# EAGLE schematic swift-nav (EAGLE 6.1)

## Sheet 1 of 2
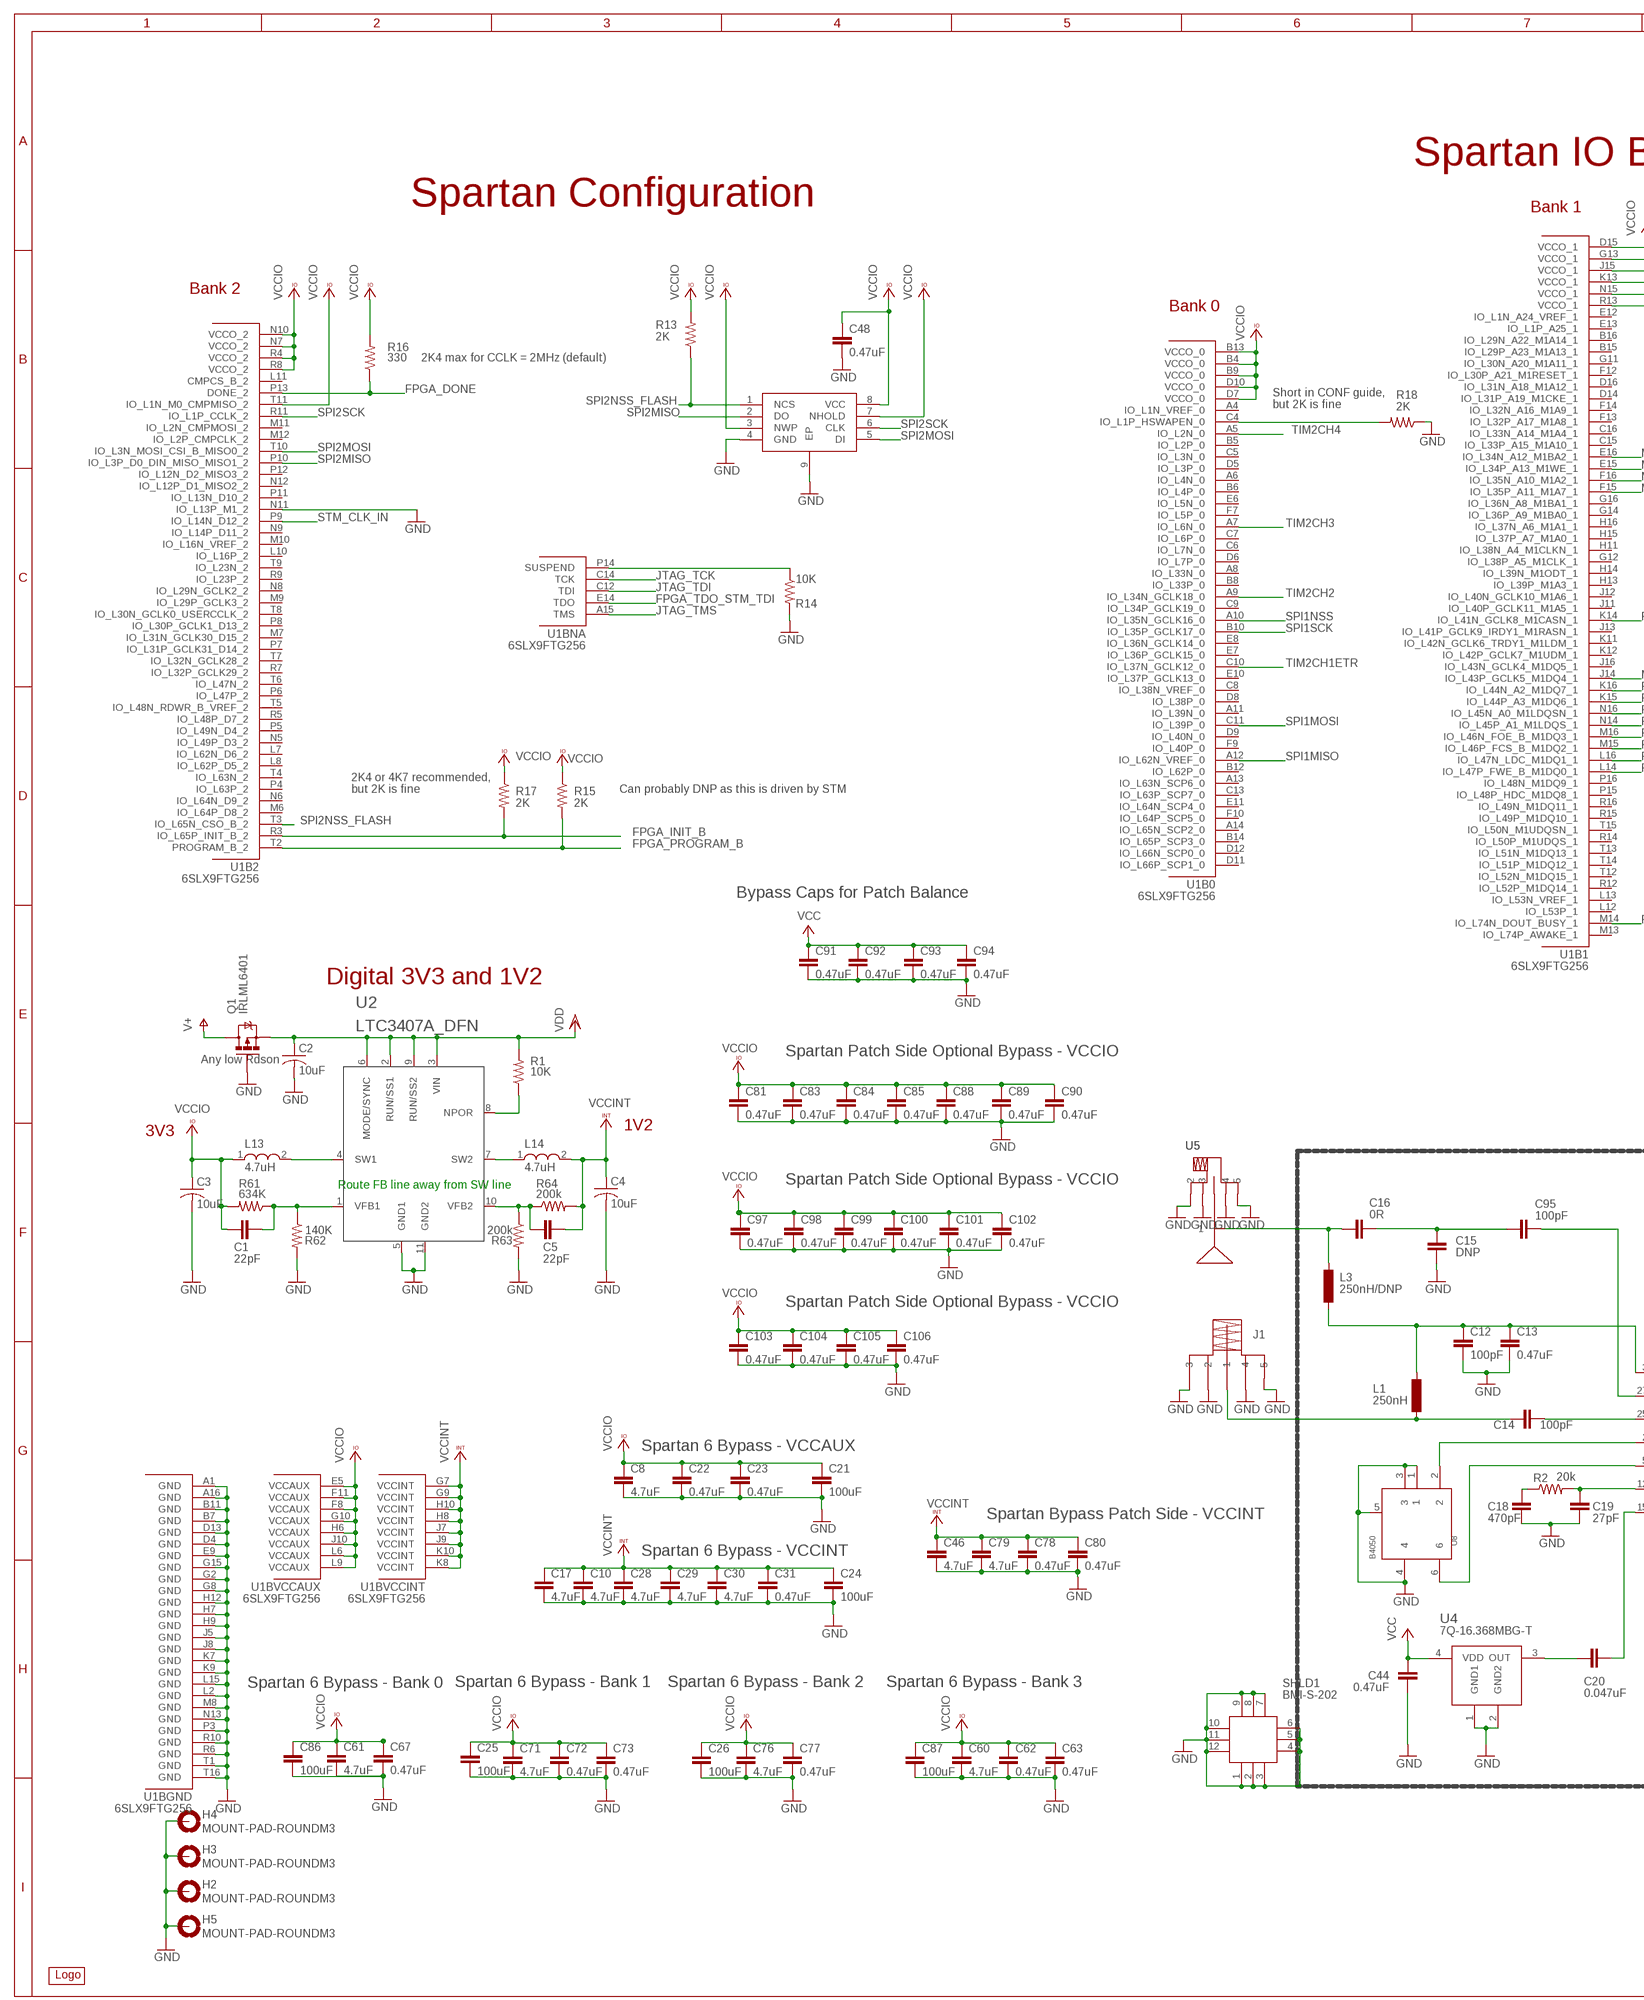
[diagram p0: schematic, sheet 1, part 1 of 2]
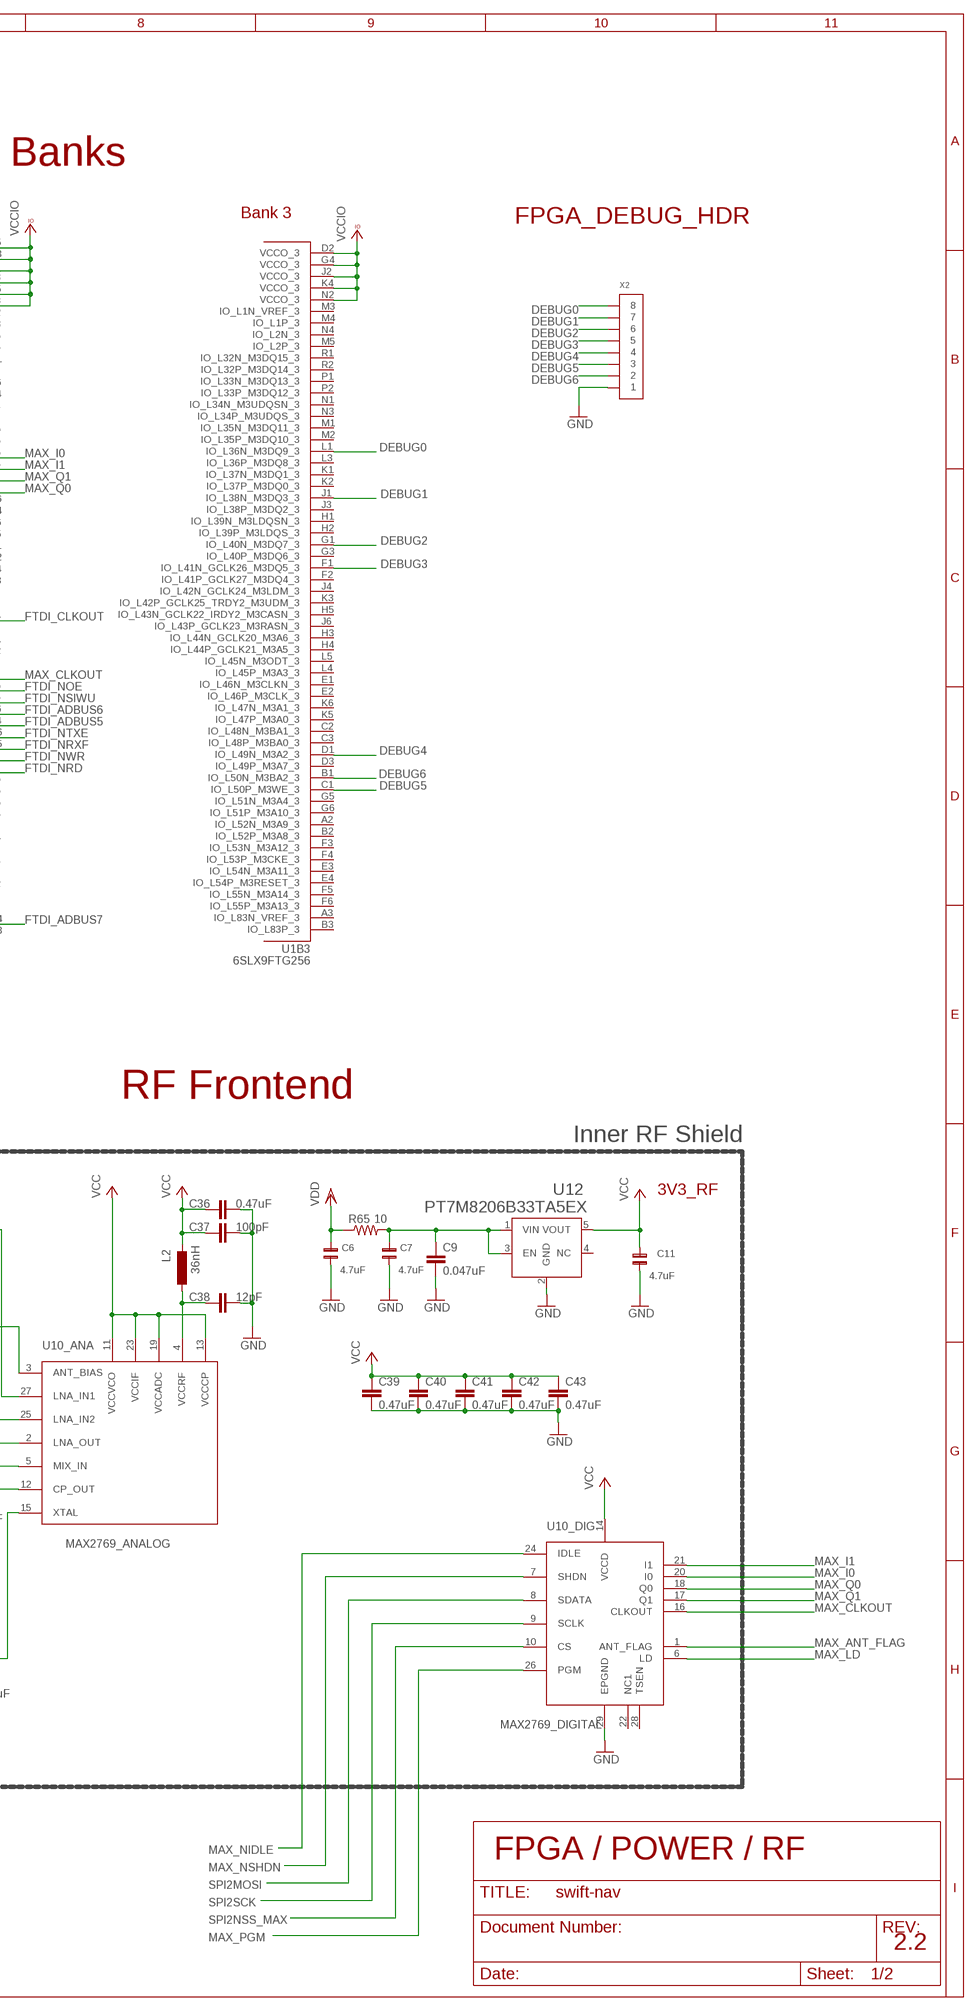
[diagram p1: schematic, sheet 1, part 2 of 2]

### Parts
C1  22pF  C-EUC0402  [C0402]
C2  10uF  C-USC1206  [C1206]
C3  10uF  C-USC1206  [C1206]
C4  10uF  C-USC1206  [C1206]
C5  22pF  C-EUC0402  [C0402]
C6  4.7uF  C0603  [0603]
C7  4.7uF  C0603  [0603]
C8  4.7uF  C-EUC0603K  [C0603K]
C9  0.047uF  C-EUC0402  [C0402]
C10  4.7uF  C-EUC0603K  [C0603K]
C11  4.7uF  C0603  [0603]
C12  100pF  C-EUC0402  [C0402]
C13  0.47uF  C-EUC0402  [C0402]
C14  100pF  C-EUC0402  [C0402]
C15  DNP  C-EUC0402  [C0402]
C16  0R  C-EUC0402  [C0402]
C17  4.7uF  C-EUC0603K  [C0603K]
C18  470pF  C-EUC0402  [C0402]
C19  27pF  C-EUC0402  [C0402]
C20  0.047uF  C-EUC0402  [C0402]
C21  100uF  C-EUC1210K  [C1210K]
C22  0.47uF  C-EUC0402  [C0402]
C23  0.47uF  C-EUC0402  [C0402]
C24  100uF  C-EUC1210K  [C1210K]
C25  100uF  C-EUC1210K  [C1210K]
C26  100uF  C-EUC1210K  [C1210K]
C28  4.7uF  C-EUC0603K  [C0603K]
C29  4.7uF  C-EUC0603K  [C0603K]
C30  4.7uF  C-EUC0603K  [C0603K]
C31  0.47uF  C-EUC0402  [C0402]
C36  0.47uF  C-EUC0402  [C0402]
C37  100pF  C-EUC0402  [C0402]
C38  12pF  C-EUC0402  [C0402]
C39  0.47uF  C-EUC0402  [C0402]
C40  0.47uF  C-EUC0402  [C0402]
C41  0.47uF  C-EUC0402  [C0402]
C42  0.47uF  C-EUC0402  [C0402]
C43  0.47uF  C-EUC0402  [C0402]
C44  0.47uF  C-EUC0402  [C0402]
C46  4.7uF  C-EUC0603K  [C0603K]
C48  0.47uF  C-EUC0402  [C0402]
C60  4.7uF  C-EUC0603K  [C0603K]
C61  4.7uF  C-EUC0603K  [C0603K]
C62  0.47uF  C-EUC0402  [C0402]
C63  0.47uF  C-EUC0402  [C0402]
C67  0.47uF  C-EUC0402  [C0402]
C71  4.7uF  C-EUC0603K  [C0603K]
C72  0.47uF  C-EUC0402  [C0402]
C73  0.47uF  C-EUC0402  [C0402]
C76  4.7uF  C-EUC0603K  [C0603K]
C77  0.47uF  C-EUC0402  [C0402]
C78  0.47uF  C-EUC0402  [C0402]
C79  4.7uF  C-EUC0603K  [C0603K]
C80  0.47uF  C-EUC0402  [C0402]
C81  0.47uF  C-EUC0402  [C0402]
C83  0.47uF  C-EUC0402  [C0402]
C84  0.47uF  C-EUC0402  [C0402]
C85  0.47uF  C-EUC0402  [C0402]
C86  100uF  C-EUC1210K  [C1210K]
C87  100uF  C-EUC1210K  [C1210K]
C88  0.47uF  C-EUC0402  [C0402]
C89  0.47uF  C-EUC0402  [C0402]
C90  0.47uF  C-EUC0402  [C0402]
C91  0.47uF  C-EUC0402  [C0402]
C92  0.47uF  C-EUC0402  [C0402]
C93  0.47uF  C-EUC0402  [C0402]
C94  0.47uF  C-EUC0402  [C0402]
C95  100pF  C-EUC0402  [C0402]
C97  0.47uF  C-EUC0402  [C0402]
C98  0.47uF  C-EUC0402  [C0402]
C99  0.47uF  C-EUC0402  [C0402]
C100  0.47uF  C-EUC0402  [C0402]
C101  0.47uF  C-EUC0402  [C0402]
C102  0.47uF  C-EUC0402  [C0402]
C103  0.47uF  C-EUC0402  [C0402]
C104  0.47uF  C-EUC0402  [C0402]
C105  0.47uF  C-EUC0402  [C0402]
C106  0.47uF  C-EUC0402  [C0402]
H2  MOUNT-PAD-ROUNDM3  [M3-PAD]
H3  MOUNT-PAD-ROUNDM3  [M3-PAD]
H4  MOUNT-PAD-ROUNDM3  [M3-PAD]
H5  MOUNT-PAD-ROUNDM3  [M3-PAD]
J1  SMA_EDGE  [SMA_EDGE]
L1  250nH  INDUCTOR-0402  [0402-IND]
L2  36nH  INDUCTOR-0402  [0402-IND]
L3  250nH/DNP  INDUCTOR-0402  [0402-IND]
L13  4.7uH  LQM2HPN4R7MG0L  [LQM2HPN4R7MG0L]
L14  4.7uH  LQM2HPN4R7MG0L  [LQM2HPN4R7MG0L]
Q1  IRLML6401  MOSFET-PCHANNELSMD  [SOT23-3]
R1  10K  R-US_R0402  [R0402]
R2  20k  R-US_R0402  [R0402]
R13  2K  R-US_R0402  [R0402]
R14  10K  R-US_R0402  [R0402]
R15  2K  R-US_R0402  [R0402]
R16  330  R-US_R0402  [R0402]
R17  2K  R-US_R0402  [R0402]
R18  2K  R-US_R0402  [R0402]
R61  634K  R-US_R0402  [R0402]
R62  140K  R-US_R0402  [R0402]
R63  200k  R-US_R0402  [R0402]
R64  200k  R-US_R0402  [R0402]
R65  10  R-US_R0402  [R0402]
SHLD1  BMI-S-202  [BMI-S-202]
U1  6SLX9FTG256  [FT256]
U2  LTC3407A_DFN  [DFN10]
U4  7Q-16.368MBG-T  [TCX_7Q]
U5  SMA_PATCH  [SMA_PATCH]
U8  B4050  [B4050]
U10  MAX2769  [MAX2769]
U12  PT7M8206B33TA5EX  [PT7M8206B33TA5EX]
U13  M25PX80  M25P80_MLP8  [M25P80_MLP8]
U$1  LOGOINITIALS  [INITIALS]
X2  CONN_8-1-53261  [PB-53261-08]

### Nets
DEBUG0: U1.L1(B3:IO_L36N_M3DQ9_3) X2.8
DEBUG1: U1.J1(B3:IO_L38N_M3DQ3_3) X2.7
DEBUG2: U1.G1(B3:IO_L40N_M3DQ7_3) X2.6
DEBUG3: U1.F1(B3:IO_L41N_GCLK26_M3DQ5_3) X2.5
DEBUG4: U1.D1(B3:IO_L49N_M3A2_3) X2.4
DEBUG5: U1.C1(B3:IO_L50P_M3WE_3) X2.3
DEBUG6: U1.B1(B3:IO_L50N_M3BA2_3) X2.2
FE_CLK: C20.2 U4.3(OUT)
FPGA_DONE: R16.1 U1.P13(B2:DONE_2) ; also sheet 2
FPGA_INIT_B: R17.2 U1.R3(B2:IO_L65P_INIT_B_2) ; also sheet 2
FPGA_PROGRAM_B: R15.2 U1.T2(B2:PROGRAM_B_2) ; also sheet 2
FPGA_TDO_STM_TDI: U1.E14(BNA:TDO) ; also sheet 2
FTDI_ADBUS5: U1.N14(B1:IO_L45P_A1_M1LDQS_1) ; also sheet 2
FTDI_ADBUS6: U1.N16(B1:IO_L45N_A0_M1LDQSN_1) ; also sheet 2
FTDI_ADBUS7: U1.M14(B1:IO_L74N_DOUT_BUSY_1) ; also sheet 2
FTDI_CLKOUT: U1.K14(B1:IO_L41N_GCLK8_M1CASN_1) ; also sheet 2
FTDI_NOE: U1.K16(B1:IO_L44N_A2_M1DQ7_1) ; also sheet 2
FTDI_NRD: U1.L14(B1:IO_L47P_FWE_B_M1DQ0_1) ; also sheet 2
FTDI_NRXF: U1.M15(B1:IO_L46P_FCS_B_M1DQ2_1) ; also sheet 2
FTDI_NSIWU: U1.K15(B1:IO_L44P_A3_M1DQ6_1) ; also sheet 2
FTDI_NTXE: U1.M16(B1:IO_L46N_FOE_B_M1DQ3_1) ; also sheet 2
FTDI_NWR: U1.L16(B1:IO_L47N_LDC_M1DQ1_1) ; also sheet 2
GND: C2.2 C3.2 C4.2 C6.1 C7.1 C8.2 C9.2 C10.2 C11.1 C12.2 C13.2 C15.1 C17.2 C18.2 C19.2 C21.2 C22.2 C23.2 C24.2 C25.2 C26.2 C28.2 C29.2 C30.2 C31.2 C36.2 C37.2 C38.2 C39.2 C40.2 C41.2 C42.2 C43.2 C44.2 C46.2 C48.2 C60.2 C61.2 C62.2 C63.2 C67.2 C71.2 C72.2 C73.2 C76.2 C77.2 C78.2 C79.2 C80.2 C81.2 C83.2 C84.2 C85.2 C86.2 C87.2 C88.2 C89.2 C90.2 C91.2 C92.2 C93.2 C94.2 C97.2 C98.2 C99.2 C100.2 C101.2 C102.2 C103.2 C104.2 C105.2 C106.2 H2.B3,0(MOUNT) H3.B3,0(MOUNT) H4.B3,0(MOUNT) H5.B3,0(MOUNT) J1.P2 J1.P3 J1.P4 J1.P5 Q1.1(G) R14.2 R18.1 R62.2 R63.2 SHLD1.1 SHLD1.2 SHLD1.3 SHLD1.4 SHLD1.5 SHLD1.6 SHLD1.7 SHLD1.8 SHLD1.9 SHLD1.10 SHLD1.11 SHLD1.12 U1.A1(BGND:GND) U1.A16(BGND:GND) U1.B7(BGND:GND) U1.B11(BGND:GND) U1.D4(BGND:GND) U1.D13(BGND:GND) U1.E9(BGND:GND) U1.G2(BGND:GND) U1.G8(BGND:GND) U1.G15(BGND:GND) U1.H7(BGND:GND) U1.H9(BGND:GND) U1.H12(BGND:GND) U1.J5(BGND:GND) U1.J8(BGND:GND) U1.K7(BGND:GND) U1.K9(BGND:GND) U1.L2(BGND:GND) U1.L15(BGND:GND) U1.M8(BGND:GND) U1.N11(B2:IO_L13P_M1_2) U1.N13(BGND:GND) U1.P3(BGND:GND) U1.R6(BGND:GND) U1.R10(BGND:GND) U1.T1(BGND:GND) U1.T16(BGND:GND) U2.5(GND1) U2.11(GND2) U4.1(GND1) U4.2(GND2) U5.P2 U5.P3 U5.P4 U5.P5 U8.1 U8.3 U8.4 U8.5 U10.29(_DIG:EPGND) U12.2(GND) U13.4(GND) U13.9(EP) X2.1 ; also sheet 2
JTAG_TCK: U1.C14(BNA:TCK) ; also sheet 2
JTAG_TDI: U1.C12(BNA:TDI) ; also sheet 2
JTAG_TMS: U1.A15(BNA:TMS) ; also sheet 2
MAX_ANT_FLAG: U10.1(_DIG:ANT_FLAG) ; also sheet 2
MAX_CLKOUT: U1.J14(B1:IO_L43P_GCLK5_M1DQ4_1) U10.16(_DIG:CLKOUT)
MAX_I0: U1.E16(B1:IO_L34N_A12_M1BA2_1) U10.20(_DIG:I0)
MAX_I1: U1.E15(B1:IO_L34P_A13_M1WE_1) U10.21(_DIG:I1)
MAX_LD: U10.6(_DIG:LD) ; also sheet 2
MAX_NIDLE: U10.24(_DIG:IDLE) ; also sheet 2
MAX_NSHDN: U10.7(_DIG:SHDN) ; also sheet 2
MAX_PGM: U10.26(_DIG:PGM) ; also sheet 2
MAX_Q0: U1.F15(B1:IO_L35P_A11_M1A7_1) U10.18(_DIG:Q0)
MAX_Q1: U1.F16(B1:IO_L35N_A10_M1A2_1) U10.17(_DIG:Q1)
N$3: C18.1 R2.1
N$4: C19.1 R2.2 U10.12(_ANA:CP_OUT)
N$5: U8.2 U10.2(_ANA:LNA_OUT)
N$6: C20.1 U10.15(_ANA:XTAL)
N$7: U8.6 U10.5(_ANA:MIX_IN)
N$8: C14.1 J1.P1 L1.P$1
N$10: C12.1 C13.1 L1.P$2 L3.P$1 U10.3(_ANA:ANT_BIAS)
N$11: C95.2 U10.27(_ANA:LNA_IN1)
N$14: C16.2 L3.P$2 U5.P1
N$16: R1.1 U2.8(NPOR)
N$17: L13.2 U2.4(SW1)
N$22: C38.1 L2.P$1 U10.4(_ANA:VCCRF)
N$26: L14.1 U2.7(SW2)
N$30: C14.2 U10.25(_ANA:LNA_IN2)
N$31: R18.2 U1.C4(B0:IO_L1P_HSWAPEN_0)
N$34: R14.1 U1.P14(BNA:SUSPEND)
N$35: C15.2 C16.1 C95.1
N$53: C1.1 R61.1 R62.1 U2.1(VFB1)
N$54: C5.2 R63.1 R64.1 U2.10(VFB2)
N$56: C7.2 C9.1 R65.2 U12.1(VIN) U12.3(EN)
SPI1MISO: U1.A12(B0:IO_L62N_VREF_0) ; also sheet 2
SPI1MOSI: U1.C11(B0:IO_L39P_0) ; also sheet 2
SPI1NSS: U1.A10(B0:IO_L35N_GCLK16_0) ; also sheet 2
SPI1SCK: U1.B10(B0:IO_L35P_GCLK17_0) ; also sheet 2
SPI2MISO: U1.P10(B2:IO_L3P_D0_DIN_MISO_MISO1_2) U13.2(DO) ; also sheet 2
SPI2MOSI: U1.T10(B2:IO_L3N_MOSI_CSI_B_MISO0_2) U10.8(_DIG:SDATA) U13.5(DI) ; also sheet 2
SPI2NSS_FLASH: R13.1 U1.T3(B2:IO_L65N_CSO_B_2) U13.1(NCS) ; also sheet 2
SPI2NSS_MAX: U10.10(_DIG:CS) ; also sheet 2
SPI2SCK: U1.R11(B2:IO_L1P_CCLK_2) U10.9(_DIG:SCLK) U13.6(CLK) ; also sheet 2
STM_CLK_IN: U1.P9(B2:IO_L14N_D12_2) ; also sheet 2
TIM2CH1ETR: U1.C10(B0:IO_L37N_GCLK12_0) ; also sheet 2
TIM2CH2: U1.A9(B0:IO_L34N_GCLK18_0) ; also sheet 2
TIM2CH3: U1.A7(B0:IO_L6N_0) ; also sheet 2
TIM2CH4: U1.A5(B0:IO_L2N_0) ; also sheet 2
V+: Q1.3(D) ; also sheet 2
VCC: C11.2 C36.1 C37.1 C39.1 C40.1 C41.1 C42.1 C43.1 C44.1 C91.1 C92.1 C93.1 C94.1 L2.P$2 U4.4(VDD) U10.11(_ANA:VCCVCO) U10.13(_ANA:VCCCP) U10.14(_DIG:VCCD) U10.19(_ANA:VCCADC) U10.23(_ANA:VCCIF) U12.5(VOUT)
VCCINT: C4.1 C5.1 C10.1 C17.1 C24.1 C28.1 C29.1 C30.1 C31.1 C46.1 C78.1 C79.1 C80.1 L14.2 R64.2 U1.G7(BVCCINT:VCCINT) U1.G9(BVCCINT:VCCINT) U1.H8(BVCCINT:VCCINT) U1.H10(BVCCINT:VCCINT) U1.J7(BVCCINT:VCCINT) U1.J9(BVCCINT:VCCINT) U1.K8(BVCCINT:VCCINT) U1.K10(BVCCINT:VCCINT)
VCCIO: C1.2 C3.1 C8.1 C21.1 C22.1 C23.1 C25.1 C26.1 C48.1 C60.1 C61.1 C62.1 C63.1 C67.1 C71.1 C72.1 C73.1 C76.1 C77.1 C81.1 C83.1 C84.1 C85.1 C86.1 C87.1 C88.1 C89.1 C90.1 C97.1 C98.1 C99.1 C100.1 C101.1 C102.1 C103.1 C104.1 C105.1 C106.1 L13.1 R13.2 R15.1 R16.2 R17.1 R61.2 U1.B4(B0:VCCO_0) U1.B9(B0:VCCO_0) U1.B13(B0:VCCO_0) U1.D2(B3:VCCO_3) U1.D7(B0:VCCO_0) U1.D10(B0:VCCO_0) U1.D15(B1:VCCO_1) U1.E5(BVCCAUX:VCCAUX) U1.F8(BVCCAUX:VCCAUX) U1.F11(BVCCAUX:VCCAUX) U1.G4(B3:VCCO_3) U1.G10(BVCCAUX:VCCAUX) U1.G13(B1:VCCO_1) U1.H6(BVCCAUX:VCCAUX) U1.J2(B3:VCCO_3) U1.J10(BVCCAUX:VCCAUX) U1.J15(B1:VCCO_1) U1.K4(B3:VCCO_3) U1.K13(B1:VCCO_1) U1.L6(BVCCAUX:VCCAUX) U1.L9(BVCCAUX:VCCAUX) U1.N2(B3:VCCO_3) U1.N7(B2:VCCO_2) U1.N10(B2:VCCO_2) U1.N15(B1:VCCO_1) U1.R4(B2:VCCO_2) U1.R8(B2:VCCO_2) U1.R13(B1:VCCO_1) U1.T11(B2:IO_L1N_M0_CMPMISO_2) U13.3(NWP) U13.7(NHOLD) U13.8(VCC) ; also sheet 2
VDD: C2.1 C6.2 Q1.2(S) R1.2 R65.1 U2.2(RUN/SS1) U2.3(VIN) U2.6(MODE/SYNC) U2.9(RUN/SS2)
Unconnected: U1.A2(B3:IO_L52N_M3A9_3) U1.A3(B3:IO_L83N_VREF_3) U1.A4(B0:IO_L1N_VREF_0) U1.A6(B0:IO_L4N_0) U1.A8(B0:IO_L33N_0) U1.A11(B0:IO_L39N_0) U1.A13(B0:IO_L63N_SCP6_0) U1.A14(B0:IO_L65N_SCP2_0) U1.B2(B3:IO_L52P_M3A8_3) U1.B3(B3:IO_L83P_3) U1.B5(B0:IO_L2P_0) U1.B6(B0:IO_L4P_0) U1.B8(B0:IO_L33P_0) U1.B12(B0:IO_L62P_0) U1.B14(B0:IO_L65P_SCP3_0) U1.B15(B1:IO_L29P_A23_M1A13_1) U1.B16(B1:IO_L29N_A22_M1A14_1) U1.C2(B3:IO_L48N_M3BA1_3) U1.C3(B3:IO_L48P_M3BA0_3) U1.C5(B0:IO_L3N_0) U1.C6(B0:IO_L7N_0) U1.C7(B0:IO_L6P_0) U1.C8(B0:IO_L38N_VREF_0) U1.C9(B0:IO_L34P_GCLK19_0) U1.C13(B0:IO_L63P_SCP7_0) U1.C15(B1:IO_L33P_A15_M1A10_1) U1.C16(B1:IO_L33N_A14_M1A4_1) U1.D3(B3:IO_L49P_M3A7_3) U1.D5(B0:IO_L3P_0) U1.D6(B0:IO_L7P_0) U1.D8(B0:IO_L38P_0) U1.D9(B0:IO_L40N_0) U1.D11(B0:IO_L66P_SCP1_0) U1.D12(B0:IO_L66N_SCP0_0) U1.D14(B1:IO_L31P_A19_M1CKE_1) U1.D16(B1:IO_L31N_A18_M1A12_1) U1.E1(B3:IO_L46N_M3CLKN_3) U1.E2(B3:IO_L46P_M3CLK_3) U1.E3(B3:IO_L54N_M3A11_3) U1.E4(B3:IO_L54P_M3RESET_3) U1.E6(B0:IO_L5N_0) U1.E7(B0:IO_L36P_GCLK15_0) U1.E8(B0:IO_L36N_GCLK14_0) U1.E10(B0:IO_L37P_GCLK13_0) U1.E11(B0:IO_L64N_SCP4_0) U1.E12(B1:IO_L1N_A24_VREF_1) U1.E13(B1:IO_L1P_A25_1) U1.F2(B3:IO_L41P_GCLK27_M3DQ4_3) U1.F3(B3:IO_L53N_M3A12_3) U1.F4(B3:IO_L53P_M3CKE_3) U1.F5(B3:IO_L55N_M3A14_3) U1.F6(B3:IO_L55P_M3A13_3) U1.F7(B0:IO_L5P_0) U1.F9(B0:IO_L40P_0) U1.F10(B0:IO_L64P_SCP5_0) U1.F12(B1:IO_L30P_A21_M1RESET_1) U1.F13(B1:IO_L32P_A17_M1A8_1) U1.F14(B1:IO_L32N_A16_M1A9_1) U1.G3(B3:IO_L40P_M3DQ6_3) U1.G5(B3:IO_L51N_M3A4_3) U1.G6(B3:IO_L51P_M3A10_3) U1.G11(B1:IO_L30N_A20_M1A11_1) U1.G12(B1:IO_L38P_A5_M1CLK_1) U1.G14(B1:IO_L36P_A9_M1BA0_1) U1.G16(B1:IO_L36N_A8_M1BA1_1) U1.H1(B3:IO_L39N_M3LDQSN_3) U1.H2(B3:IO_L39P_M3LDQS_3) U1.H3(B3:IO_L44N_GCLK20_M3A6_3) U1.H4(B3:IO_L44P_GCLK21_M3A5_3) U1.H5(B3:IO_L43N_GCLK22_IRDY2_M3CASN_3) U1.H11(B1:IO_L38N_A4_M1CLKN_1) U1.H13(B1:IO_L39P_M1A3_1) U1.H14(B1:IO_L39N_M1ODT_1) U1.H15(B1:IO_L37P_A7_M1A0_1) U1.H16(B1:IO_L37N_A6_M1A1_1) U1.J3(B3:IO_L38P_M3DQ2_3) U1.J4(B3:IO_L42N_GCLK24_M3LDM_3) U1.J6(B3:IO_L43P_GCLK23_M3RASN_3) U1.J11(B1:IO_L40P_GCLK11_M1A5_1) U1.J12(B1:IO_L40N_GCLK10_M1A6_1) U1.J13(B1:IO_L41P_GCLK9_IRDY1_M1RASN_1) U1.J16(B1:IO_L43N_GCLK4_M1DQ5_1) U1.K1(B3:IO_L37N_M3DQ1_3) U1.K2(B3:IO_L37P_M3DQ0_3) U1.K3(B3:IO_L42P_GCLK25_TRDY2_M3UDM_3) U1.K5(B3:IO_L47P_M3A0_3) U1.K6(B3:IO_L47N_M3A1_3) U1.K11(B1:IO_L42N_GCLK6_TRDY1_M1LDM_1) U1.K12(B1:IO_L42P_GCLK7_M1UDM_1) U1.L3(B3:IO_L36P_M3DQ8_3) U1.L4(B3:IO_L45P_M3A3_3) U1.L5(B3:IO_L45N_M3ODT_3) U1.L7(B2:IO_L62N_D6_2) U1.L8(B2:IO_L62P_D5_2) U1.L10(B2:IO_L16P_2) U1.L11(B2:CMPCS_B_2) U1.L12(B1:IO_L53P_1) U1.L13(B1:IO_L53N_VREF_1) U1.M1(B3:IO_L35N_M3DQ11_3) U1.M2(B3:IO_L35P_M3DQ10_3) U1.M3(B3:IO_L1N_VREF_3) U1.M4(B3:IO_L1P_3) U1.M5(B3:IO_L2P_3) U1.M6(B2:IO_L64P_D8_2) U1.M7(B2:IO_L31N_GCLK30_D15_2) U1.M9(B2:IO_L29P_GCLK3_2) U1.M10(B2:IO_L16N_VREF_2) U1.M11(B2:IO_L2N_CMPMOSI_2) U1.M12(B2:IO_L2P_CMPCLK_2) U1.M13(B1:IO_L74P_AWAKE_1) U1.N1(B3:IO_L34N_M3UDQSN_3) U1.N3(B3:IO_L34P_M3UDQS_3) U1.N4(B3:IO_L2N_3) U1.N5(B2:IO_L49P_D3_2) U1.N6(B2:IO_L64N_D9_2) U1.N8(B2:IO_L29N_GCLK2_2) U1.N9(B2:IO_L14P_D11_2) U1.N12(B2:IO_L12P_D1_MISO2_2) U1.P1(B3:IO_L33N_M3DQ13_3) U1.P2(B3:IO_L33P_M3DQ12_3) U1.P4(B2:IO_L63P_2) U1.P5(B2:IO_L49N_D4_2) U1.P6(B2:IO_L47P_2) U1.P7(B2:IO_L31P_GCLK31_D14_2) U1.P8(B2:IO_L30P_GCLK1_D13_2) U1.P11(B2:IO_L13N_D10_2) U1.P12(B2:IO_L12N_D2_MISO3_2) U1.P15(B1:IO_L48P_HDC_M1DQ8_1) U1.P16(B1:IO_L48N_M1DQ9_1) U1.R1(B3:IO_L32N_M3DQ15_3) U1.R2(B3:IO_L32P_M3DQ14_3) U1.R5(B2:IO_L48P_D7_2) U1.R7(B2:IO_L32P_GCLK29_2) U1.R9(B2:IO_L23P_2) U1.R12(B1:IO_L52P_M1DQ14_1) U1.R14(B1:IO_L50P_M1UDQS_1) U1.R15(B1:IO_L49P_M1DQ10_1) U1.R16(B1:IO_L49N_M1DQ11_1) U1.T4(B2:IO_L63N_2) U1.T5(B2:IO_L48N_RDWR_B_VREF_2) U1.T6(B2:IO_L47N_2) U1.T7(B2:IO_L32N_GCLK28_2) U1.T8(B2:IO_L30N_GCLK0_USERCCLK_2) U1.T9(B2:IO_L23N_2) U1.T12(B1:IO_L52N_M1DQ15_1) U1.T13(B1:IO_L51N_M1DQ13_1) U1.T14(B1:IO_L51P_M1DQ12_1) U1.T15(B1:IO_L50N_M1UDQSN_1) U10.22(_DIG:NC1) U10.28(_DIG:TSEN) U12.4(NC)

### Notes on the sheet
- Spartan IO Banks
- Spartan Configuration
- Bank 1
- Bank 3
- FPGA_DEBUG_HDR
- Bank 2
- Bank 0
- 2K4 max for CCLK = 2MHz (default)
- Short in CONF guide,
- but 2K is fine
- 2K4 or 4K7 recommended,
- but 2K is fine | Can probably DNP as this is driven by STM
- Bypass Caps for Patch Balance
- Digital 3V3 and 1V2
- Spartan Patch Side Optional Bypass - VCCIO
- Any low Rdson
- RF Frontend
- 1V2
- 3V3
- Inner RF Shield
- Spartan Patch Side Optional Bypass - VCCIO
- Route FB line away from SW line
- 3V3_RF
- Spartan Patch Side Optional Bypass - VCCIO
- Spartan 6 Bypass - VCCAUX
- Spartan Bypass Patch Side - VCCINT
- Spartan 6 Bypass - VCCINT
- Spartan 6 Bypass - Bank 0 | Spartan 6 Bypass - Bank 1 | Spartan 6 Bypass - Bank 2 | Spartan 6 Bypass - Bank 3
- FPGA / POWER / RF
- 2.2

## Sheet 2 of 2
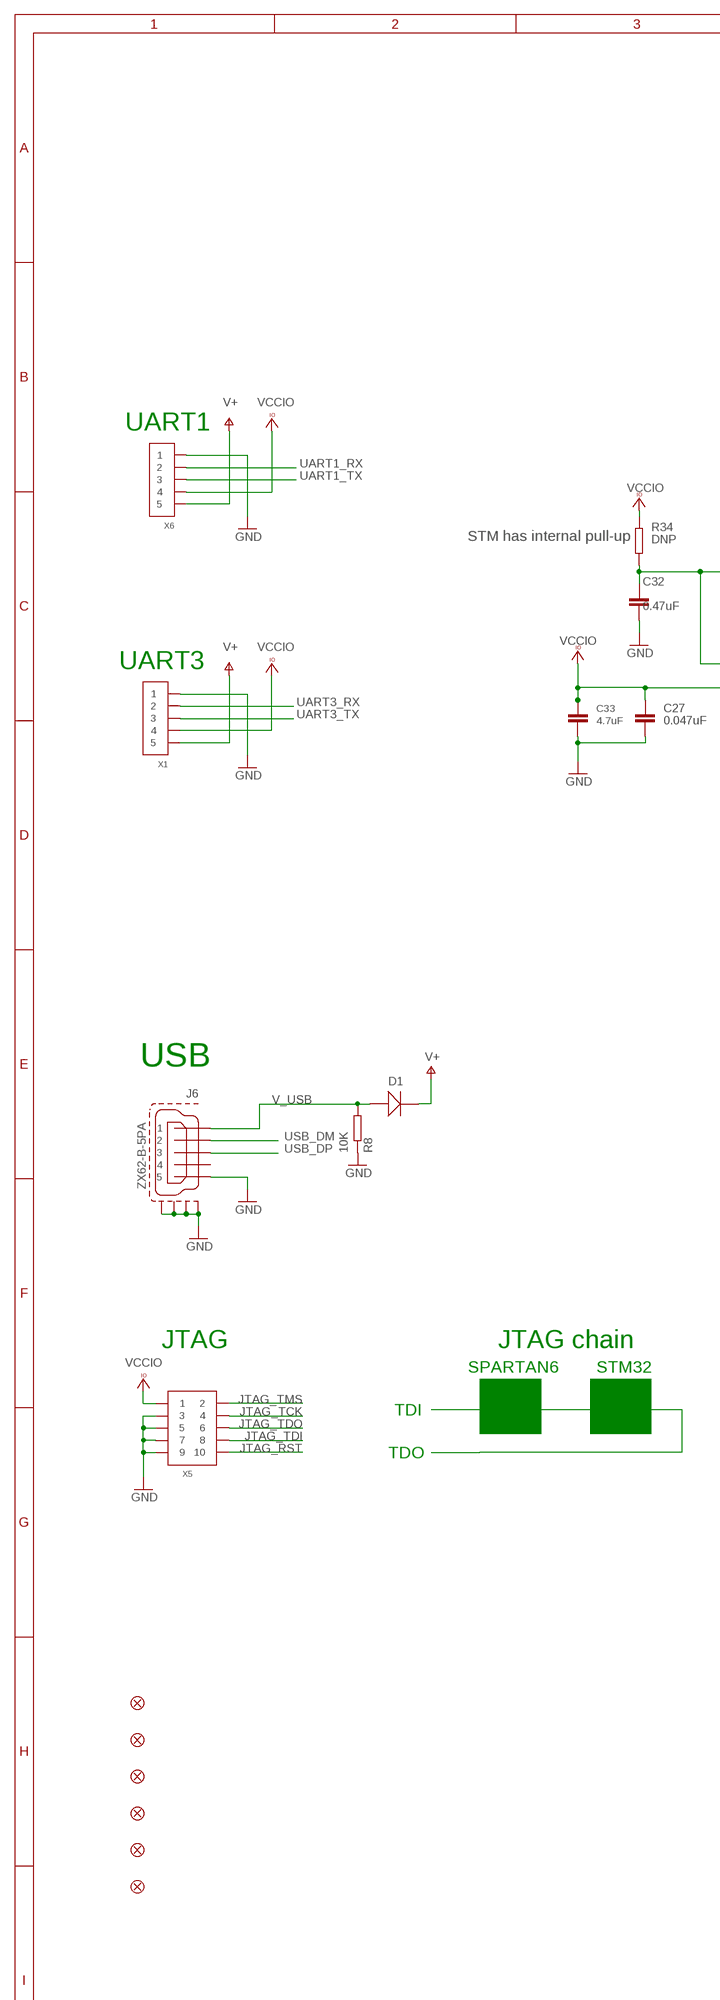
[diagram p2: schematic, sheet 2, part 1 of 2]
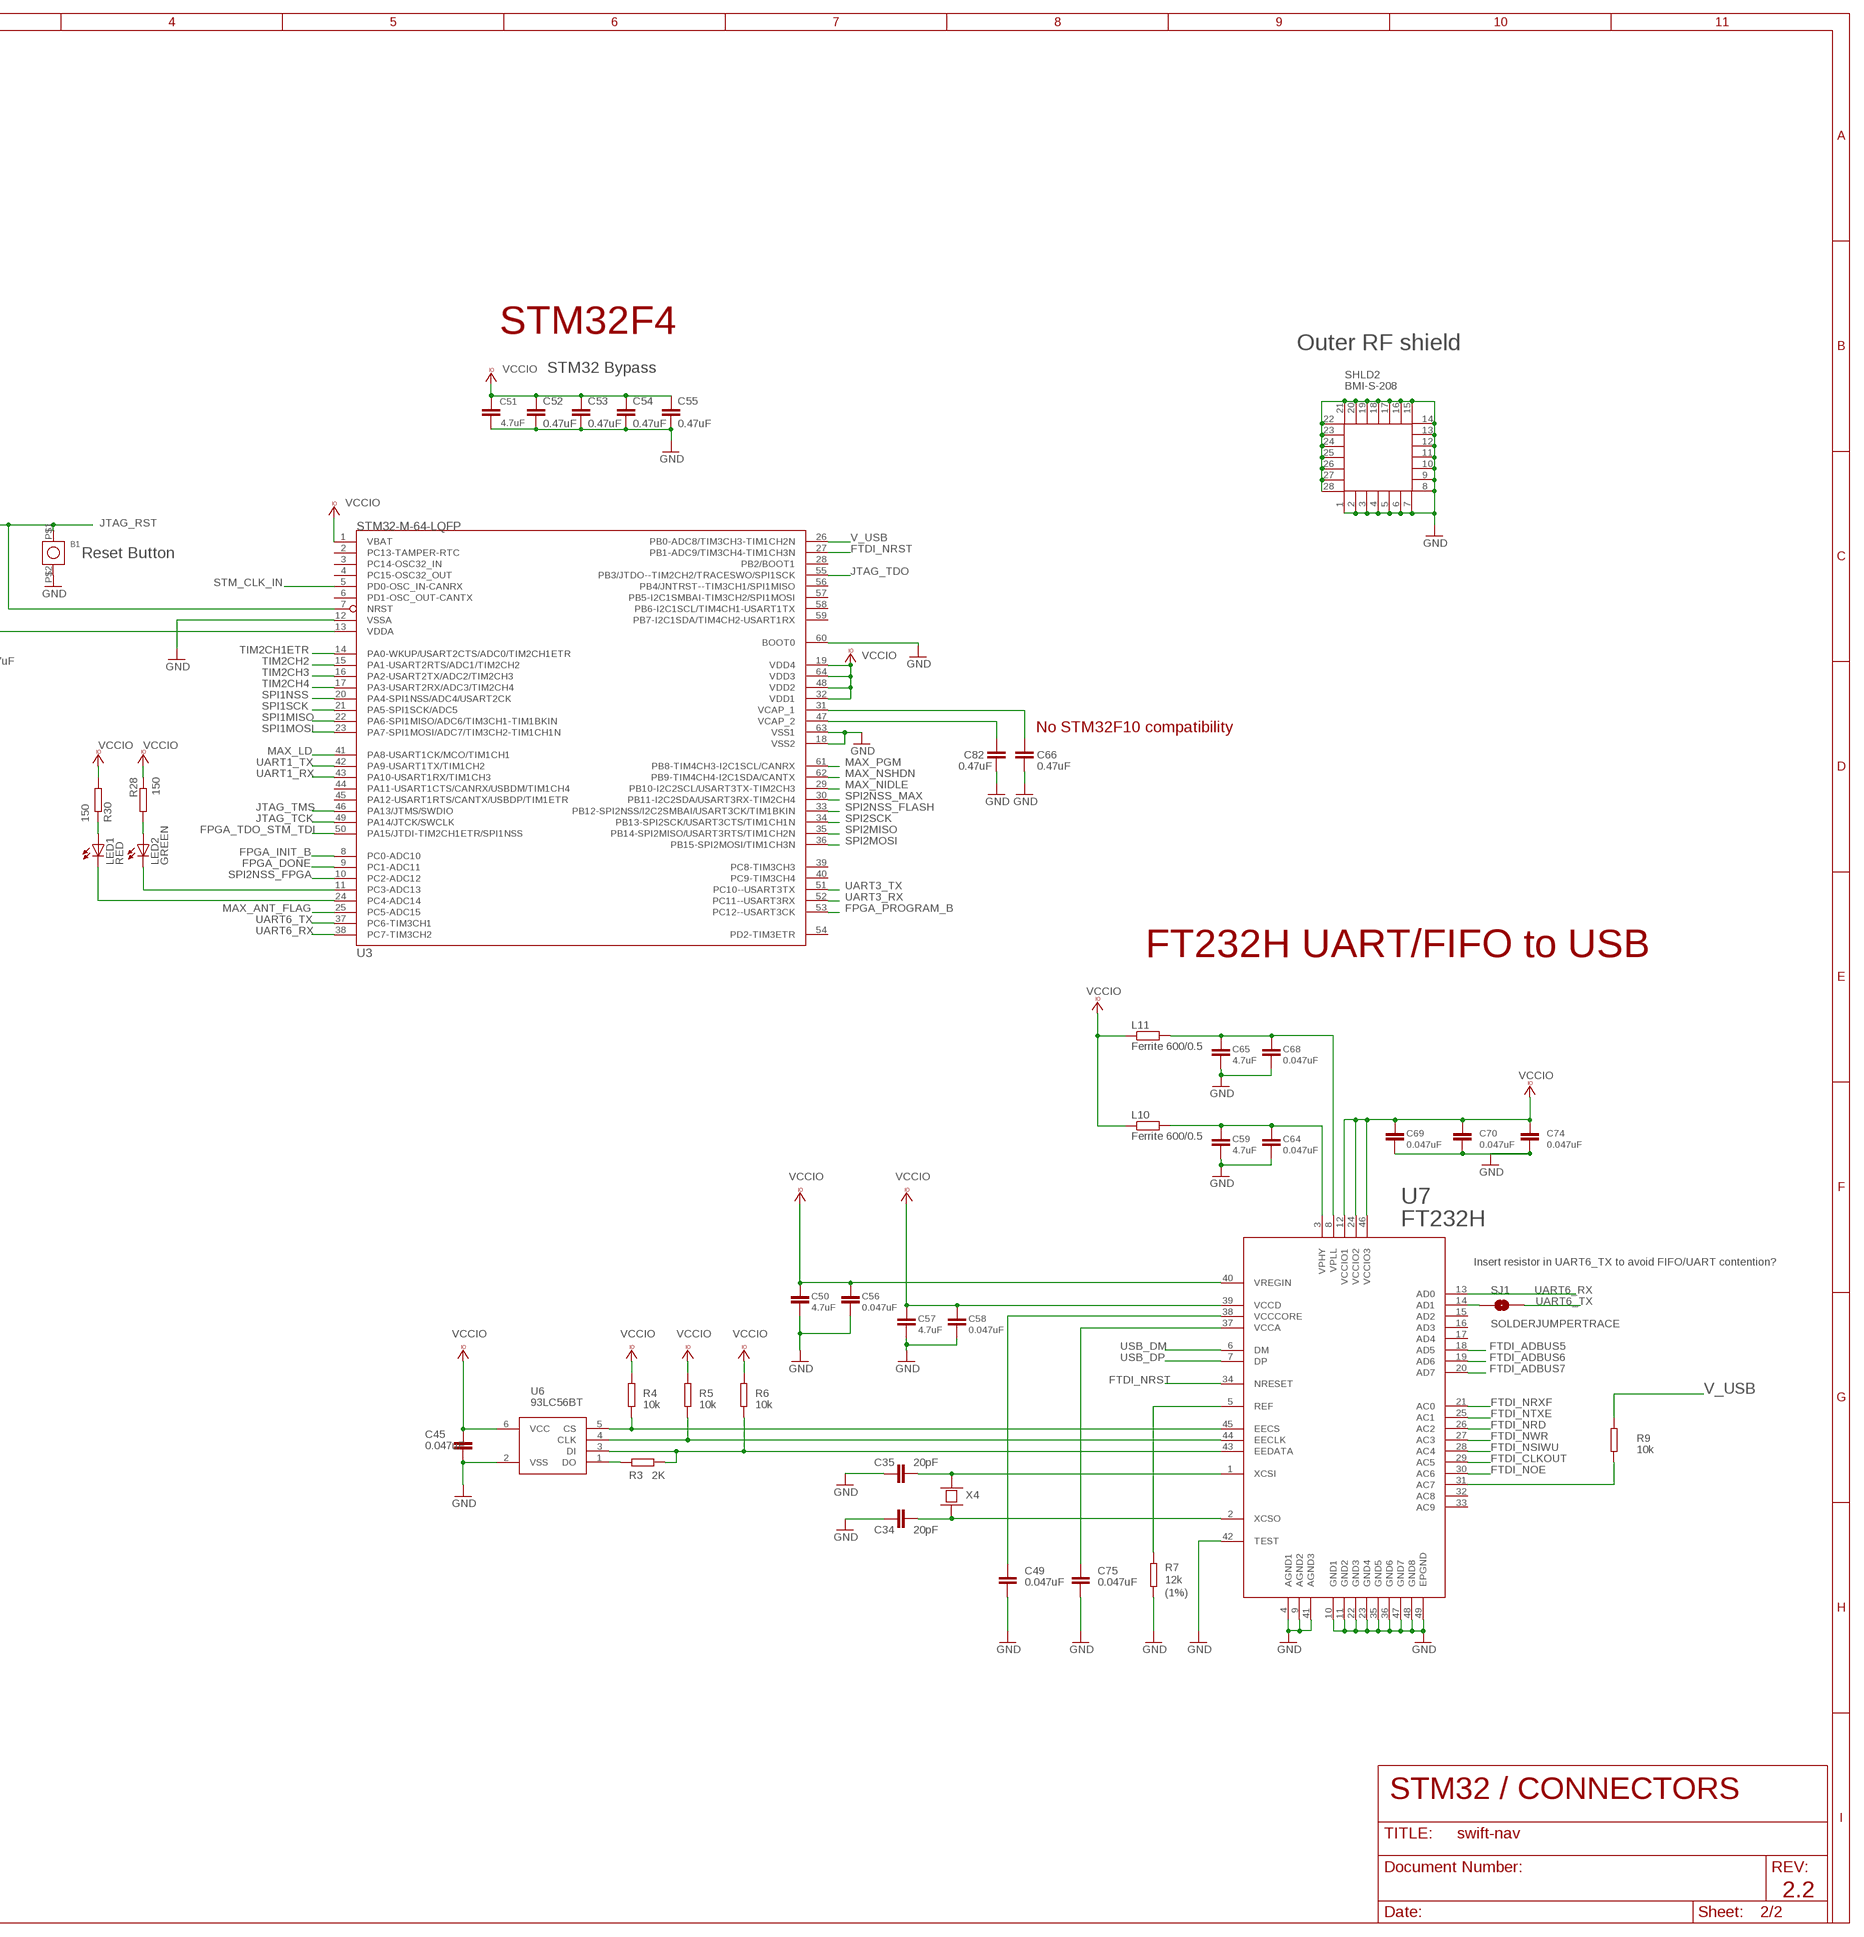
[diagram p3: schematic, sheet 2, part 2 of 2]

### Parts
B1  B3U-1000P  [B3U-1000P]
C27  0.047uF  C-EUC0402  [C0402]
C32  0.47uF  C-EUC0402  [C0402]
C33  4.7uF  C-EUC0603K  [C0603K]
C34  20pF  C-EUC0402  [C0402]
C35  20pF  C-EUC0402  [C0402]
C45  0.047uF  C-EUC0402  [C0402]
C49  0.047uF  C-EUC0402  [C0402]
C50  4.7uF  C-EUC0603K  [C0603K]
C51  4.7uF  C-EUC0603K  [C0603K]
C52  0.47uF  C-EUC0402  [C0402]
C53  0.47uF  C-EUC0402  [C0402]
C54  0.47uF  C-EUC0402  [C0402]
C55  0.47uF  C-EUC0402  [C0402]
C56  0.047uF  C-EUC0603K  [C0603K]
C57  4.7uF  C-EUC0603K  [C0603K]
C58  0.047uF  C-EUC0603K  [C0603K]
C59  4.7uF  C-EUC0603K  [C0603K]
C64  0.047uF  C-EUC0603K  [C0603K]
C65  4.7uF  C-EUC0603K  [C0603K]
C66  0.47uF  C-EUC0402  [C0402]
C68  0.047uF  C-EUC0603K  [C0603K]
C69  0.047uF  C-EUC0603  [C0603]
C70  0.047uF  C-EUC0603K  [C0603K]
C74  0.047uF  C-EUC0603K  [C0603K]
C75  0.047uF  C-EUC0402  [C0402]
C82  0.47uF  C-EUC0402  [C0402]
D1  MBR0520  [SOD-123]
J6  ZX62-B-5PA  [ZX62-B-5PA]
JP5  FIDUCIAL1.5X3  [FIDUCIAL-1.5X3]
JP6  FIDUCIAL1.5X3  [FIDUCIAL-1.5X3]
JP7  FIDUCIAL1.5X3  [FIDUCIAL-1.5X3]
JP8  FIDUCIAL1.5X3  [FIDUCIAL-1.5X3]
JP9  FIDUCIAL1.5X3  [FIDUCIAL-1.5X3]
JP10  FIDUCIAL1.5X3  [FIDUCIAL-1.5X3]
L10  Ferrite 600/0.5  R-EU_R0805  [R0805]
L11  Ferrite 600/0.5  R-EU_R0805  [R0805]
LED1  RED  LEDCHIP-LED0603  [CHIP-LED0603]
LED2  GREEN  LEDCHIP-LED0603  [CHIP-LED0603]
R3  2K  RESISTOR-0402  [0402-RES]
R4  10k  RESISTOR-0402  [0402-RES]
R5  10k  RESISTOR-0402  [0402-RES]
R6  10k  RESISTOR-0402  [0402-RES]
R7  12k  RESISTOR-0402  [0402-RES]
R8  10K  RESISTOR-0402  [0402-RES]
R9  10k  RESISTOR-0402  [0402-RES]
R28  150  RESISTOR-0402  [0402-RES]
R30  150  RESISTOR-0402  [0402-RES]
R34  DNP  RESISTOR-0402  [0402-RES]
SHLD2  BMI-S-208  [BMI-S-208]
SJ1  SOLDERJUMPERTRACE  [SJ_2S-TRACE]
U3  STM32-M-64-LQFP  [LQFP64]
U6  93LC56BT-I/OT  [93AA56BT-I/OT]
U7  FT232HQ  [FT232HQ]
X1  CONN_5-1-53261  [PB-53261-05]
X4  NX5032GA-12M  [NX5032GA]
X5  CONN_5-2  [FTSH-105-D]
X6  CONN_5-1-53261  [PB-53261-05]

### Nets
FPGA_DONE: U3.9(PC1-ADC11) ; also sheet 1
FPGA_INIT_B: U3.8(PC0-ADC10) ; also sheet 1
FPGA_PROGRAM_B: U3.53(PC12--USART3CK) ; also sheet 1
FPGA_TDO_STM_TDI: U3.50(PA15/JTDI-TIM2CH1ETR/SPI1NSS) ; also sheet 1
FTDI_ADBUS5: U7.18(AD5) ; also sheet 1
FTDI_ADBUS6: U7.19(AD6) ; also sheet 1
FTDI_ADBUS7: U7.20(AD7) ; also sheet 1
FTDI_CLKOUT: U7.29(AC5) ; also sheet 1
FTDI_NOE: U7.30(AC6) ; also sheet 1
FTDI_NRD: U7.26(AC2) ; also sheet 1
FTDI_NRST: U3.27(PB1-ADC9/TIM3CH4-TIM1CH3N) U7.34(NRESET)
FTDI_NRXF: U7.21(AC0) ; also sheet 1
FTDI_NSIWU: U7.28(AC4) ; also sheet 1
FTDI_NTXE: U7.25(AC1) ; also sheet 1
FTDI_NWR: U7.27(AC3) ; also sheet 1
GND: B1.P$2 C27.2 C32.2 C33.1 C34.2 C35.2 C45.2 C49.2 C50.1 C51.1 C52.2 C53.2 C54.2 C55.2 C56.2 C57.1 C58.2 C59.1 C64.2 C65.1 C66.2 C68.2 C69.2 C70.2 C74.2 C75.2 C82.1 J6.GND_LEFT(S1) J6.GND_RIGHT(S2) J6.GND_UP_LEFT(S3) J6.GND_UP_RIGHT(S4) J6.PIN_5 R7.P$2 R8.P$1 SHLD2.1 SHLD2.2 SHLD2.3 SHLD2.4 SHLD2.5 SHLD2.6 SHLD2.7 SHLD2.8 SHLD2.9 SHLD2.10 SHLD2.11 SHLD2.12 SHLD2.13 SHLD2.14 SHLD2.15 SHLD2.16 SHLD2.17 SHLD2.18 SHLD2.19 SHLD2.20 SHLD2.21 SHLD2.22 SHLD2.23 SHLD2.24 SHLD2.25 SHLD2.26 SHLD2.27 SHLD2.28 U3.12(VSSA) U3.18(VSS2) U3.60(BOOT0) U3.63(VSS1) U6.2(VSS) U7.4(AGND1) U7.9(AGND2) U7.10(GND1) U7.11(GND2) U7.22(GND3) U7.23(GND4) U7.35(GND5) U7.36(GND6) U7.41(AGND3) U7.42(TEST) U7.47(GND7) U7.48(GND8) U7.49(EPGND) X1.1 X5.3 X5.5 X5.7 X5.9 X6.1 ; also sheet 1
JTAG_RST: B1.P$1 C32.1 R34.P$1 U3.7(NRST) X5.10
JTAG_TCK: U3.49(PA14/JTCK/SWCLK) X5.4 ; also sheet 1
JTAG_TDI: X5.8 ; also sheet 1
JTAG_TDO: U3.55(PB3/JTDO--TIM2CH2/TRACESWO/SPI1SCK) X5.6
JTAG_TMS: U3.46(PA13/JTMS/SWDIO) X5.2 ; also sheet 1
MAX_ANT_FLAG: U3.25(PC5-ADC15) ; also sheet 1
MAX_LD: U3.41(PA8-USART1CK/MCO/TIM1CH1) ; also sheet 1
MAX_NIDLE: U3.29(PB10-I2C2SCL/USART3TX-TIM2CH3) ; also sheet 1
MAX_NSHDN: U3.62(PB9-TIM4CH4-I2C1SDA/CANTX) ; also sheet 1
MAX_PGM: U3.61(PB8-TIM4CH3-I2C1SCL/CANRX) ; also sheet 1
N$2: SJ1.1 U7.14(AD1)
N$9: C34.1 U7.2(XCSO) X4.2
N$15: C35.1 U7.1(XCSI) X4.1
N$19: C49.1 U7.38(VCCCORE)
N$20: R9.P$2 U7.31(AC7)
N$21: C65.2 C68.1 L11.2 U7.8(VPLL)
N$23: R4.P$2 U6.5(CS) U7.45(EECS)
N$24: LED1.A R30.P$1
N$25: R5.P$2 U6.4(CLK) U7.44(EECLK)
N$27: R3.P$1 R6.P$2 U6.3(DI) U7.43(EEDATA)
N$28: R3.P$2 U6.1(DO)
N$29: C59.2 C64.1 L10.2 U7.3(VPHY)
N$32: C75.1 U7.37(VCCA)
N$33: R7.P$1 U7.5(REF)
N$39: LED1.C U3.24(PC4-ADC14)
N$55: LED2.A R28.P$2
N$59: LED2.C U3.11(PC3-ADC13)
SPI1MISO: U3.22(PA6-SPI1MISO/ADC6/TIM3CH1-TIM1BKIN) ; also sheet 1
SPI1MOSI: U3.23(PA7-SPI1MOSI/ADC7/TIM3CH2-TIM1CH1N) ; also sheet 1
SPI1NSS: U3.20(PA4-SPI1NSS/ADC4/USART2CK) ; also sheet 1
SPI1SCK: U3.21(PA5-SPI1SCK/ADC5) ; also sheet 1
SPI2MISO: U3.35(PB14-SPI2MISO/USART3RTS/TIM1CH2N) ; also sheet 1
SPI2MOSI: U3.36(PB15-SPI2MOSI/TIM1CH3N) ; also sheet 1
SPI2NSS_FLASH: U3.33(PB12-SPI2NSS/I2C2SMBAI/USART3CK/TIM1BKIN) ; also sheet 1
SPI2NSS_FPGA: U3.10(PC2-ADC12)
SPI2NSS_MAX: U3.30(PB11-I2C2SDA/USART3RX-TIM2CH4) ; also sheet 1
SPI2SCK: U3.34(PB13-SPI2SCK/USART3CTS/TIM1CH1N) ; also sheet 1
STM_CLK_IN: U3.5(PD0-OSC_IN-CANRX) ; also sheet 1
TIM2CH1ETR: U3.14(PA0-WKUP/USART2CTS/ADC0/TIM2CH1ETR) ; also sheet 1
TIM2CH2: U3.15(PA1-USART2RTS/ADC1/TIM2CH2) ; also sheet 1
TIM2CH3: U3.16(PA2-USART2TX/ADC2/TIM2CH3) ; also sheet 1
TIM2CH4: U3.17(PA3-USART2RX/ADC3/TIM2CH4) ; also sheet 1
UART1_RX: U3.43(PA10-USART1RX/TIM1CH3) X6.2
UART1_TX: U3.42(PA9-USART1TX/TIM1CH2) X6.3
UART3_RX: U3.52(PC11--USART3RX) X1.2
UART3_TX: U3.51(PC10--USART3TX) X1.3
UART6_RX: U3.38(PC7-TIM3CH2) U7.13(AD0)
UART6_TX: SJ1.2 U3.37(PC6-TIM3CH1)
USB_DM: J6.PIN_2 U7.6(DM)
USB_DP: J6.PIN_3 U7.7(DP)
V+: D1.2 X1.5 X6.5 ; also sheet 1
V_USB: D1.1 J6.PIN_1 R8.P$2 R9.P$1 U3.26(PB0-ADC8/TIM3CH3-TIM1CH2N)
VCCIO: C27.1 C33.2 C45.1 C50.2 C51.2 C52.1 C53.1 C54.1 C55.1 C56.1 C57.2 C58.1 C69.1 C70.1 C74.1 L10.1 L11.1 R4.P$1 R5.P$1 R6.P$1 R28.P$1 R30.P$2 R34.P$2 U3.1(VBAT) U3.13(VDDA) U3.19(VDD4) U3.32(VDD1) U3.48(VDD2) U3.64(VDD3) U6.6(VCC) U7.12(VCCIO1) U7.24(VCCIO2) U7.39(VCCD) U7.40(VREGIN) U7.46(VCCIO3) X1.4 X5.1 X6.4 ; also sheet 1
VSS1: C66.1 U3.31(VCAP_1)
VSS2: C82.2 U3.47(VCAP_2)
Unconnected: J6.PIN_4 U3.2(PC13-TAMPER-RTC) U3.3(PC14-OSC32_IN) U3.4(PC15-OSC32_OUT) U3.6(PD1-OSC_OUT-CANTX) U3.28(PB2/BOOT1) U3.39(PC8-TIM3CH3) U3.40(PC9-TIM3CH4) U3.44(PA11-USART1CTS/CANRX/USBDM/TIM1CH4) U3.45(PA12-USART1RTS/CANTX/USBDP/TIM1ETR) U3.54(PD2-TIM3ETR) U3.56(PB4/JNTRST--TIM3CH1/SPI1MISO) U3.57(PB5-I2C1SMBAI-TIM3CH2/SPI1MOSI) U3.58(PB6-I2C1SCL/TIM4CH1-USART1TX) U3.59(PB7-I2C1SDA/TIM4CH2-USART1RX) U7.15(AD2) U7.16(AD3) U7.17(AD4) U7.32(AC8) U7.33(AC9)

### Notes on the sheet
- STM32F4
- Outer RF shield
- STM32 Bypass
- UART1
- STM has internal pull-up
- Reset Button
- UART3
- No STM32F10 compatibility
- FT232H UART/FIFO to USB
- USB
- JTAG | JTAG chain
- SPARTAN6 | STM32
- Insert resistor in UART6_TX to avoid FIFO/UART contention?
- TDI
- TDO
- (1%)
- STM32 / CONNECTORS
- 2.2

## Library data of the parts
B1 = jobygnss:B3U-1000P
C1 C5 C8-C10 C12-C46 C48-C95 C97-C106 = rcl:C-EU: CAPACITOR, European symbol
C2-C4 = rcl:C-US: CAPACITOR, American symbol
C6 C7 C11 = capsmd:C0603
D1 = swift-nav:MBR0520
H2-H5 = swift-nav:MOUNT-PAD-ROUND: MOUNTING PAD, round
J1 = swift-nav:SMA_EDGE
J6 = open-bldc:ZX62-B-5PA
JP5-JP10 = aspirin:FIDUCIAL: Fiducial Alignment Points Various fiducial points for machine vision alignment.
L1-L3 = pel_dipol_comp:INDUCTOR
L10 L11 = rcl:R-EU_: RESISTOR, European symbol
L13 L14 = jobygnss:LQM2HPN4R7MG0L
LED1 LED2 = led:LED: LED OSRAM: - CHIPLED LG R971, LG N971, LY N971, LG Q971, LY Q971, LO R971, LY R971 LH N974, LH R974 LS Q976, LO Q976, LY Q976 LO Q996 - Hyper CHIPLED LW Q18S LB Q993, LB Q99A, LB R99A - SideLED LS A670, LO A670, LY A670, LG A670, LP A670 LB A673, LV A673, LT A673, LW A673 LH A674 LY A675 LS A676, LA A676, LO A676, LY A676, LW A676 LS A679, LY A679, LG A679 - Hyper Micro SIDELED® LS Y876, LA Y876, LO Y876, LY Y876 LT Y87S - SmartLED LW L88C, LW L88S LB L89C, LB L89S, LG L890 LS L89K, LO L89K, LY L89K LS L896, LA L896, LO L896, LY L896 - TOPLED LS T670, LO T670, LY T670, LG T670, LP T670 LSG T670, LSP T670, LSY T670, LOP T670, LYG T670 LG T671, LOG T671, LSG T671 LB T673, LV T673, LT T673, LW T673 LH T674 LS T676, LA T676, LO T676, LY T676, LB T676, LH T676, LSB T676, LW T676 LB T67C, LV T67C, LT T67C, LS T67K, LO T67K, LY T67K, LW E67C LS E67B, LA E67B, LO E67B, LY E67B, LB E67C, LV E67C, LT E67C LW T67C LS T679, LY T679, LG T679 LS T770, LO T770, LY T770, LG T770, LP T770 LB T773, LV T773, LT T773, LW T773 LH T774 LS E675, LA E675, LY E675, LS T675 LS T776, LA T776, LO T776, LY T776, LB T776 LHGB T686 LT T68C, LB T68C - Hyper Mini TOPLED® LB M676 - Mini TOPLED Santana® LG M470 LS M47K, LO M47K, LY M47K Source: http://www.osram.convergy.de LUXEON: - LUMILED® LXK2-PW12-R00, LXK2-PW12-S00, LXK2-PW14-U00, LXK2-PW14-V00 LXK2-PM12-R00, LXK2-PM12-S00, LXK2-PM14-U00 LXK2-PE12-Q00, LXK2-PE12-R00, LXK2-PE12-S00, LXK2-PE14-T00, LXK2-PE14-U00 LXK2-PB12-K00, LXK2-PB12-L00, LXK2-PB12-M00, LXK2-PB14-N00, LXK2-PB14-P00, LXK2-PB14-Q00 LXK2-PR12-L00, LXK2-PR12-M00, LXK2-PR14-Q00, LXK2-PR14-R00 LXK2-PD12-Q00, LXK2-PD12-R00, LXK2-PD12-S00 LXK2-PH12-R00, LXK2-PH12-S00 LXK2-PL12-P00, LXK2-PL12-Q00, LXK2-PL12-R00 Source: www.luxeon.com KINGBRIGHT: KA-3528ASYC Source: www.kingbright.com
Q1 = SparkFun-DiscreteSemi:MOSFET-PCHANNEL: Generic PMOSFET
R1 R2 R13-R18 R61-R65 = rcl:R-US_: RESISTOR, American symbol
R3-R9 R28 R30 R34 = pel_dipol_comp:RESISTOR
SHLD1 = jobygnss:BMI-S-202
SHLD2 = jobygnss:BMI-S-208
SJ1 = SparkFun-Passives:SOLDERJUMPER: Solder Jumper Standard SMD solder jumper. Used to automate production. Two varients : Normally Open and Normally Closed are the same, but have different paste layers. NC will have a large amount of paste and should jumper during reflow.
U1 = xilinx_devices:6SLX9FTG256: Xilinx FPGA: 6SLX9FTG256
U2 = jobygnss:LTC3407A_DFN
U3 = pel_stm32:STM32-M-64-LQFP: STM32F405 64pin LQFP
U4 = swift-nav:7Q-16.368MBG-T
U5 = joby_robotics:SMA_PATCH
U6 = swift-nav:93LC56BT-I/OT
U7 = swift-nav:FT232HQ
U8 = jobygnss:B4050
U10 = jobygnss:MAX2769
U12 = jobygnss:PT7M8206B33TA5EX
U13 = jobygnss:M25P80_MLP8
U$1 = swift-nav:LOGO
X1 X6 = pel_molex:CONN_5-1
X2 = pel_molex:CONN_8-1
X4 = swift-nav:NX5032GA-12M
X5 = pel_misc:CONN_5-2